# Altium schematic sheet ecg.SchDoc
size A4
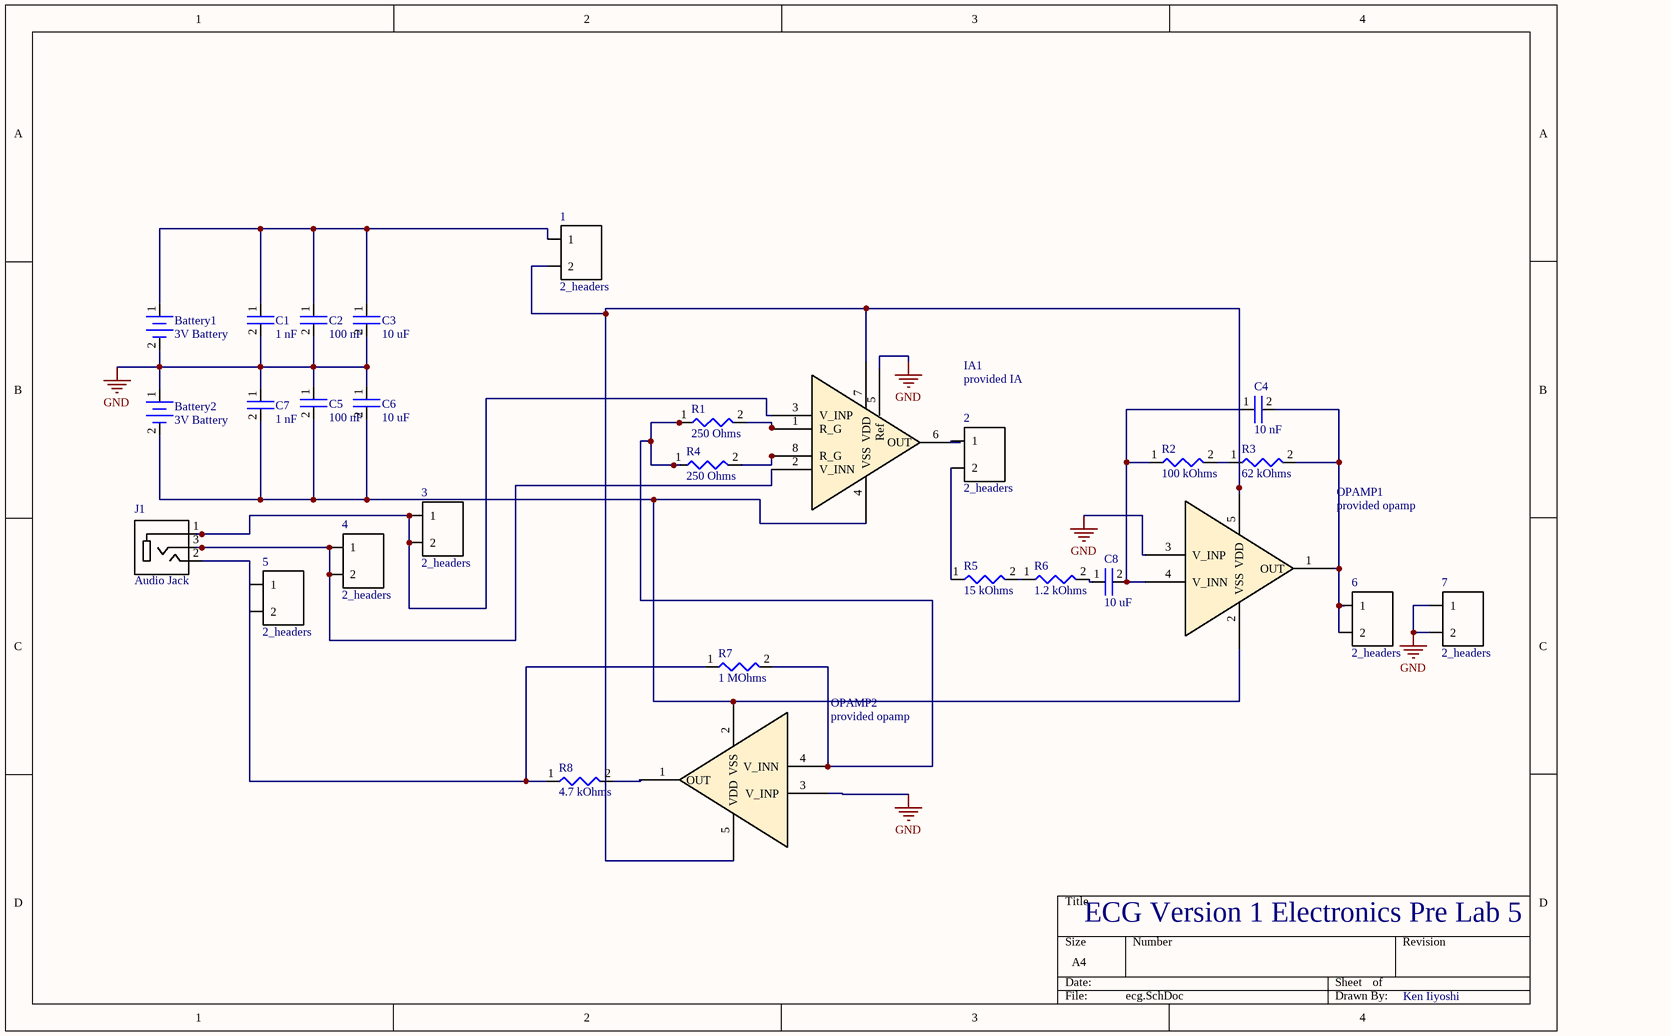
[diagram p0: ecg.SchDoc]

## Parts
1  2_headers  [3M_961102-6404-AR]
2  2_headers  [3M_961102-6404-AR]
3  2_headers  [3M_961102-6404-AR]
4  2_headers  [3M_961102-6404-AR]
5  2_headers  [3M_961102-6404-AR]
6  2_headers  [3M_961102-6404-AR]
7  2_headers  [3M_961102-6404-AR]
Battery1  3V Battery  [Battery Retainer]
Battery2  3V Battery  [Battery Retainer]
C1  1 nF  [Capacitor]
C2  100 nF  [Capacitor]
C3  10 uF  [Capacitor]
C4  10 nF  [Capacitor]
C5  100 nF  [Capacitor]
C6  10 uF  [Capacitor]
C7  1 nF  [Capacitor]
C8  10 uF  [Capacitor]
IA1  provided IA  [SOIC127P600X175-8N]
J1  Audio Jack  [CUI_SJ-3523-SMT-TR]
OPAMP1  provided opamp  [SOT65P210X110-5N]
OPAMP2  provided opamp  [SOT65P210X110-5N]
R1  250 Ohms  [Resistor]
R2  100 kOhms  [Resistor]
R3  62 kOhms  [Resistor]
R4  250 Ohms  [Resistor]
R5  15 kOhms  [Resistor]
R6  1.2 kOhms  [Resistor]
R7  1 MOhms  [Resistor]
R8  4.7 kOhms  [Resistor]

## Nets
GND: 7.1 7.2 Battery1.2 Battery2.1 C1.2 C2.2 C3.2 C5.1 C6.1 C7.1 IA1.5(Ref) OPAMP1.3(V_INP) OPAMP2.3(V_INP)
Net1_1: 1.1 Battery1.1 C1.1 C2.1 C3.1
Net1_2: 1.2 IA1.7(VDD) OPAMP1.5(VDD) OPAMP2.5(VDD)
Net2_1: 2.1 IA1.6(OUT)
Net2_2: 2.2 R5.1
Net3_1: 3.1 3.2 IA1.3(V_INP) J1.1
Net4_1: 4.1 4.2 IA1.2(V_INN) J1.3
Net5_1: 5.1 5.2 J1.2 R7.1 R8.1
Net6_1: 6.1 6.2 C4.2 OPAMP1.1(OUT) R3.2
NetBattery2_2: Battery2.2 C5.2 C6.2 C7.2 IA1.4(VSS) OPAMP1.2(VSS) OPAMP2.2(VSS)
NetC4_1: C4.1 C8.2 OPAMP1.4(V_INN) R2.1
NetC8_1: C8.1 R6.2
NetIA1_1: IA1.1(R_G) R1.2
NetIA1_8: IA1.8(R_G) R4.2
NetOPAMP2_1: OPAMP2.1(OUT) R8.2
NetOPAMP2_4: OPAMP2.4(V_INN) R1.1 R4.1 R7.2
NetR2_2: R2.2 R3.1
NetR5_2: R5.2 R6.1

## Notes on the sheet
- ECG Version 1 Electronics Pre Lab 5
- Ken Iiyoshi

## Library data of the parts
1-7 = 961102-6404-AR: BOARD TO BOARD, HEADER, 2POS, 1ROW; Series: 961; Pitch Spacing: 2.54mm; No. of Row; MF: 3M; Package: None; Digi-Key_Purchase_URL: https://www.digikey.com/product-detail/en/3m/961102-6404-AR/3M9457-02-ND/7104633?utm_source=snapeda&utm_medium=aggregator&utm_campaign=symbol; SnapEDA_Link: https://www.snapeda.com/parts/961102-6404-AR/3M%20%28TC%29/view-part/?ref=snap; MP: 961102-6404-AR; Digi-Key_Part_Number: 3M9457-02-ND; Value: *
Battery1 Battery2 = BC-2003-G-TR: Battery Retainer Coin, 20.0mm 1 Cell SMD (SMT) Tab; Manufacturer 1: Memory Protection Devices; Supplier 1: Digi-Key; Supplier Part Number 1: BC-2003-G-TR-CT-ND; Manufacturer Part Number 1: BC-2003-G-TR; Stock 1: 4670; Pricing 1: 1=0.95000, 10=0.80500, 100=0.66510, 500=0.57498 (USD); RoHS: No
C1-C8 = 08051A300JAT2A: CAP CER 30PF 100V C0G/NP0 0805; Manufacturer 1: Kyocera AVX; Dielectric Material: Ceramic; Tolerance: 5%; Dielectric: C0G; Temperature Coefficient: 30ppm/°C; Supplier 1: Digi-Key; Supplier Part Number 1: 478-3738-1-ND; Manufacturer Part Number 1: 08051A300JAT2A; Stock 1: 108048; Pricing 1: 1=0.29000, 10=0.19900, 100=0.10090, 500=0.06906, 1000=0.06110 (USD); RoHS: Yes; Mount: Surface Mount,PCB; Case/Package: 0805; Number of Pins: 2; Case Code (Imperial): 0805; Case Code (Metric): 2012; Min Operating Temperature: -55°C; Max Operating Temperature: 125°C; Packaging: Tape and Reel; Capacitance: 30pF; Voltage Rating: 100V; Package Quantity: 4000; Termination: SMD/SMT; Voltage: 100V; Voltage Rating (DC): 100V; Length: 2.01mm; Height: 0.71mm; Width: 1.25mm; Thickness: 0.037inch; Depth: 1.25mm; Radiation Hardening: No; REACH SVHC: No SVHC; Lead Free: Lead Free; ComponentLink1URL: https://datasheet.ciiva.com/151/ccog-151426.pdf?src-supplier=Digi-Key; ComponentLink1Description: https://datasheet.ciiva.com/151/ccog-151426.pdf?src-supplier=Digi-Key; ComponentLink2URL: https://datasheet.ciiva.com/151/ccog-151427.pdf?src-supplier=Digi-Key; ComponentLink2Description: https://datasheet.ciiva.com/151/ccog-151427.pdf?src-supplier=Digi-Key; ComponentLink3URL: https://datasheet.ciiva.com/151/ccog-151428.pdf?src-supplier=Digi-Key; ComponentLink3Description: https://datasheet.ciiva.com/151/ccog-151428.pdf?src-supplier=Digi-Key; ComponentLink4URL: https://datasheet.ciiva.com/7811/425357-7811893.pdf?src-supplier=Element14; ComponentLink4Description: https://datasheet.ciiva.com/7811/425357-7811893.pdf?src-supplier=Element14; ComponentLink5URL: https://datasheet.ciiva.com/7812/759117-7812312.pdf?src-supplier=Element14; ComponentLink5Description: https://datasheet.ciiva.com/7812/759117-7812312.pdf?src-supplier=Element14; ComponentLink6URL: https://datasheet.ciiva.com/16215/ccog-16215624.pdf?src-supplier=Future+Electronics; ComponentLink6Description: https://datasheet.ciiva.com/16215/ccog-16215624.pdf?src-supplier=Future+Electronics; ComponentLink7URL: https://datasheet.ciiva.com/17492/ccog-17492712.pdf?src-supplier=Avnet+Europe; ComponentLink7Description: https://datasheet.ciiva.com/17492/ccog-17492712.pdf?src-supplier=Avnet+Europe; ComponentLink8URL: https://datasheet.ciiva.com/14596/70001039-14596892.pdf?src-supplier=Allied+Electronics; ComponentLink8Description: https://datasheet.ciiva.com/14596/70001039-14596892.pdf?src-supplier=Allied+Electronics; ComponentLink9URL: https://datasheet.ciiva.com/6013/425357-6013631.pdf?src-supplier=Farnell; ComponentLink9Description: https://datasheet.ciiva.com/6013/425357-6013631.pdf?src-supplier=Farnell; 1: *; Category: Capacitors
IA1 = AD620ARZ-REEL7: IC OPAMP INSTR 1MHZ 8SOIC; Manufacturer 1: Analog Devices; Min Dual Supply Voltage: 2.3V; Max Dual Supply Voltage: 18V; Common Mode Rejection Ratio: 93dB; Number of Channels: 1; Min Supply Voltage: 4.6V; Slew Rate: 1.2V/µs; Nominal Supply Current: 900uA; Max Power Dissipation: 650mW; Input Bias Current: 500pA; Input Offset Voltage (Vos): 30mV; Operating Supply Current: 1.3mA; Output Current per Channel: 18mA; Input Resistance: 10GR; Bandwidth: 800kHz; Power Supply Rejection Ratio (PSRR): 140dB; Dual Supply Voltage: 15V; Supplier 1: Digi-Key; Supplier Part Number 1: AD620ARZ-REEL7CT-ND; Manufacturer Part Number 1: AD620ARZ-REEL7; Stock 1: 12581; Pricing 1: 1=9.81000, 10=8.85800, 25=8.44600, 100=7.33360, 250=7.00400 (USD); RoHS: Yes; Mount: Surface Mount; Case/Package: SOIC; Number of Pins: 8; Contact Plating: Tin,Matte; Min Operating Temperature: -55°C; Max Operating Temperature: 125°C; Packaging: Tape and Reel; Package Quantity: 1; -3db Bandwidth: 1MHz; Number of Circuits: 1; Number of Elements: 1; Power Dissipation: 650mW; Operating Supply Voltage: 18V; Radiation Hardening: No; Lead Free: Contains Lead; ComponentLink1URL: https://datasheet.ciiva.com/15128/getdatasheetpartid-88990-15128224.pdf?src-supplier=Verical; ComponentLink1Description: https://datasheet.ciiva.com/15128/getdatasheetpartid-88990-15128224.pdf?src-supplier=Verical; ComponentLink2URL: https://datasheet.ciiva.com/1579/26155-1579655.pdf?src-supplier=Newark; ComponentLink2Description: https://datasheet.ciiva.com/1579/26155-1579655.pdf?src-supplier=Newark; ComponentLink3URL: https://datasheet.ciiva.com/26847/ad620arz-reel7-26847213.pdf?src-supplier=IIIC; ComponentLink3Description: https://datasheet.ciiva.com/26847/ad620arz-reel7-26847213.pdf?src-supplier=IIIC; ComponentLink4URL: https://datasheet.ciiva.com/2976/ad620-2976391.pdf?src-supplier=Avnet; ComponentLink4Description: https://datasheet.ciiva.com/2976/ad620-2976391.pdf?src-supplier=Avnet; ComponentLink5URL: https://datasheet.ciiva.com/1794/ad620-1794712.pdf?src-supplier=Digi-Key; ComponentLink5Description: https://datasheet.ciiva.com/1794/ad620-1794712.pdf?src-supplier=Digi-Key; ComponentLink6URL: https://datasheet.ciiva.com/1794/ad620-1794713.pdf?src-supplier=Digi-Key; ComponentLink6Description: https://datasheet.ciiva.com/1794/ad620-1794713.pdf?src-supplier=Digi-Key; ComponentLink7URL: https://datasheet.ciiva.com/1794/ad620-1794714.pdf?src-supplier=Digi-Key; ComponentLink7Description: https://datasheet.ciiva.com/1794/ad620-1794714.pdf?src-supplier=Digi-Key; ComponentLink8URL: https://datasheet.ciiva.com/2975/ad620-2975599.pdf?src-supplier=Avnet; ComponentLink8Description: https://datasheet.ciiva.com/2975/ad620-2975599.pdf?src-supplier=Avnet; ComponentLink9URL: https://datasheet.ciiva.com/48709/001248702-da-01-en-ic-amp-inst-lp-ad620arz-reel7-soic-8-adi-48709622.pdf?src-supplier=Conrad; ComponentLink9Description: https://datasheet.ciiva.com/48709/001248702-da-01-en-ic-amp-inst-lp-ad620arz-reel7-soic-8-adi-48709622.pdf?src-supplier=Conrad
J1 = SJ-3523-SMT-TR: SJ-352x-SMT CONN JACK STEREO 3.5MM SMD R/A; Value: *; Category: Connectors, Interconnects
OPAMP1 OPAMP2 = TLV521DCKT: IC OP AMP 6KHZ RR SC-70-5; Manufacturer 1: Texas Instruments; Number of Circuits: 1; Slew Rate: 2.5V/µs; Input Bias Current: 1pA; Input Offset Voltage (Vos): 100uV; Operating Supply Current: 350nA; Output Current per Channel: 12mA; Supplier 1: Digi-Key; Supplier Part Number 1: 296-44482-1-ND; Manufacturer Part Number 1: TLV521DCKT; Stock 1: 7572; Pricing 1: 1=0.64000, 10=0.54800, 100=0.40950 (USD); RoHS: Yes; Mount: Surface Mount; Case/Package: SC; Number of Pins: 5; Min Operating Temperature: -40°C; Max Operating Temperature: 125°C; Packaging: Cut Tape; Gain Bandwidth Product: 6kHz; Bandwidth: 6kHz; Number of Amplifiers: 1; Number of Channels: 1; REACH SVHC: No SVHC; Lead Free: Lead Free; ComponentLink1URL: http://www.ti.com/general/docs/lit/getliterature.tsp?genericPartNumber=TLV521&&fileType=pdf&src-supplier=Element14; ComponentLink1Description: http://www.ti.com/general/docs/lit/getliterature.tsp?genericPartNumber=TLV521&&fileType=pdf&src-supplier=Element14; ComponentLink2URL: http://www.ti.com/lit/pdf/slyt701?src-supplier=Digi-Key; ComponentLink2Description: http://www.ti.com/lit/pdf/slyt701?src-supplier=Digi-Key; ComponentLink3URL: http://www.ti.com/lit/ds/symlink/tlv521.pdf?src-supplier=Digi-Key; ComponentLink3Description: http://www.ti.com/lit/ds/symlink/tlv521.pdf?src-supplier=Digi-Key; ComponentLink4URL: http://www.ti.com/general/docs/lit/getliterature.tsp?genericPartNumber=TLV521&amp;&amp;fileType=pdf&src-supplier=Farnell; ComponentLink4Description: http://www.ti.com/general/docs/lit/getliterature.tsp?genericPartNumber=TLV521&amp;&amp;fileType=pdf&src-supplier=Farnell
R1-R8 = CRCW0805360RFKEA: RES SMD 360 OHM 1% 1/8W 0805; Manufacturer 1: Vishay; Resistance: 360R; Temperature Coefficient: 100ppm/°C; Max Power Dissipation: 125mW; Voltage Rating (DC): 150V; Supplier 1: Digi-Key; Supplier Part Number 1: 541-360CCT-ND; Manufacturer Part Number 1: CRCW0805360RFKEA; Stock 1: 17639; Pricing 1: 1=0.10000, 10=0.06600, 100=0.02670, 1000=0.01199, 2500=0.01041 (USD); RoHS: Yes; Case/Package: 0805; Number of Pins: 2; Weight: 0.000194oz; Case Code (Metric): 2012; Case Code (Imperial): 0805; Contact Plating: Tin; Min Operating Temperature: -55°C; Max Operating Temperature: 155°C; Tolerance: 1%; Packaging: Tape and Reel; Composition: Thick Film; Package Quantity: 10; Number of Terminations: 2; Features: Automotive AEC-Q200; Power Rating: 125mW; Voltage Rating: 150V; Termination: SMD/SMT; Military Standard: Not; Length: 2mm; Height: 0.45mm; Width: 0.049inch; Depth: 1.25mm; Radiation Hardening: No; Lead Free: Lead Free; REACH SVHC: Unknown; ComponentLink1URL: https://datasheet.ciiva.com/11812/0900766b80d98b26-11812609.pdf?src-supplier=RSComponents; ComponentLink1Description: https://datasheet.ciiva.com/11812/0900766b80d98b26-11812609.pdf?src-supplier=RSComponents; ComponentLink2URL: https://datasheet.ciiva.com/7881/1697337-7881957.pdf?src-supplier=Element14; ComponentLink2Description: https://datasheet.ciiva.com/7881/1697337-7881957.pdf?src-supplier=Element14; ComponentLink3URL: https://datasheet.ciiva.com/7881/1697337-7881958.pdf?src-supplier=Element14; ComponentLink3Description: https://datasheet.ciiva.com/7881/1697337-7881958.pdf?src-supplier=Element14; ComponentLink4URL: https://datasheet.ciiva.com/8942/dcrcwe3-8942598.pdf?src-supplier=Avnet; ComponentLink4Description: https://datasheet.ciiva.com/8942/dcrcwe3-8942598.pdf?src-supplier=Avnet; ComponentLink5URL: https://datasheet.ciiva.com/22674/1847332-22674713.pdf?src-supplier=Element14; ComponentLink5Description: https://datasheet.ciiva.com/22674/1847332-22674713.pdf?src-supplier=Element14; ComponentLink6URL: https://datasheet.ciiva.com/2467/dcrcwe3-2467773.pdf?src-supplier=Digi-Key; ComponentLink6Description: https://datasheet.ciiva.com/2467/dcrcwe3-2467773.pdf?src-supplier=Digi-Key; ComponentLink7URL: https://datasheet.ciiva.com/2467/dcrcwe3-2467774.pdf?src-supplier=Digi-Key; ComponentLink7Description: https://datasheet.ciiva.com/2467/dcrcwe3-2467774.pdf?src-supplier=Digi-Key; ComponentLink8URL: https://datasheet.ciiva.com/5543/dcrcwe3-109170-5543710.pdf?src-supplier=Mouser; ComponentLink8Description: https://datasheet.ciiva.com/5543/dcrcwe3-109170-5543710.pdf?src-supplier=Mouser; ComponentLink9URL: https://datasheet.ciiva.com/2467/dcrcwe3-2467775.pdf?src-supplier=Digi-Key; ComponentLink9Description: https://datasheet.ciiva.com/2467/dcrcwe3-2467775.pdf?src-supplier=Digi-Key; Category: Resistors; Parameter 1: *